# EasyEDA Pro project ProPrj_HTXStudio_OneHanded_Keyboard.epro, schematic TypeC
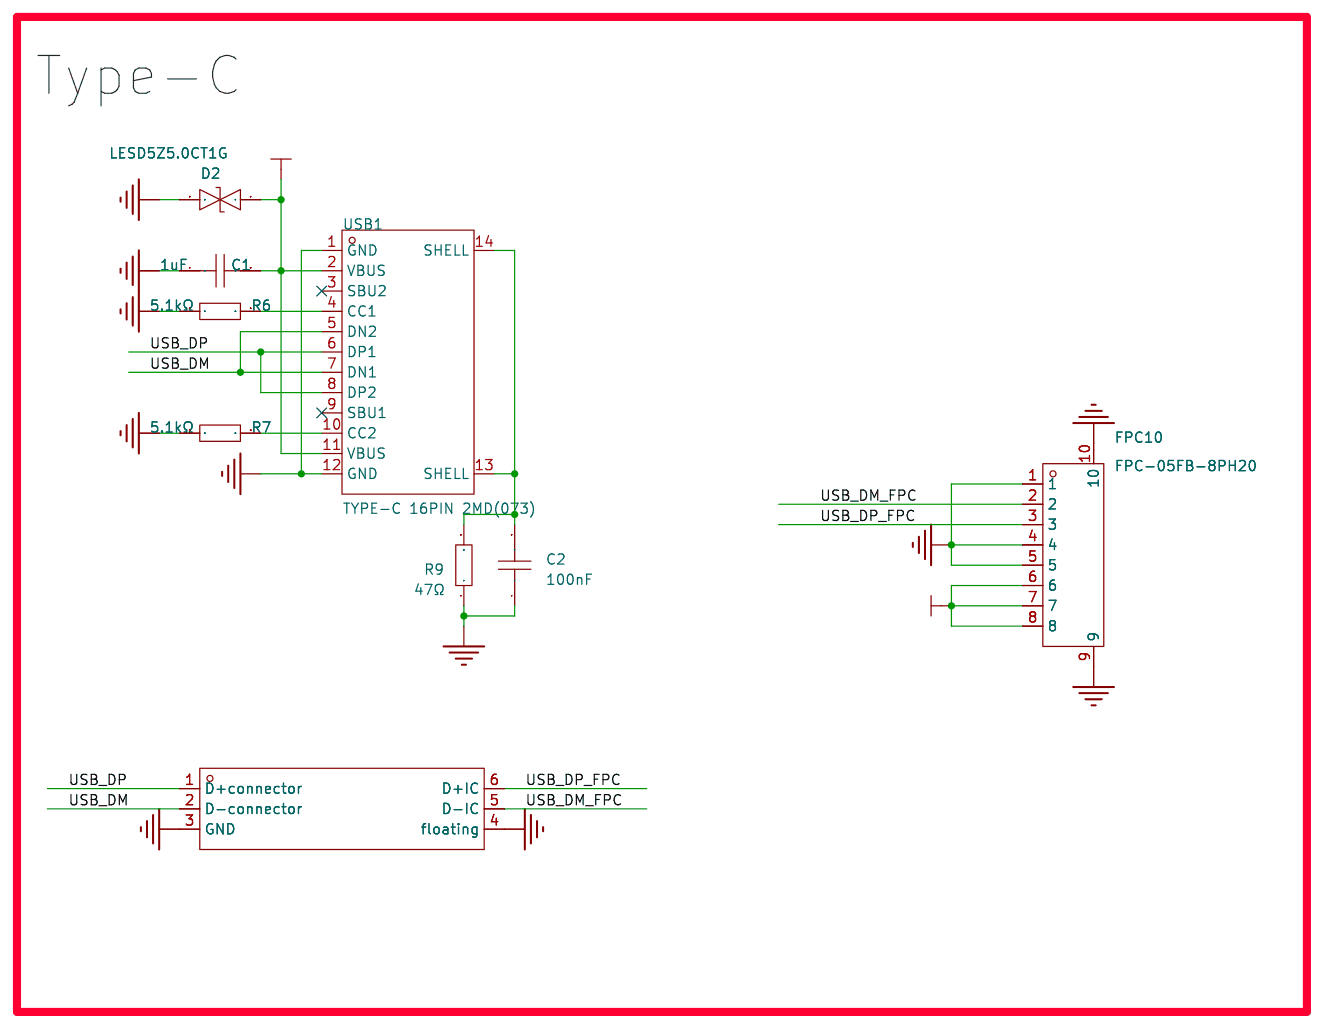
[diagram p0: schematic sheet]

## Parts
C1  1uF  [C0402]
C2  100nF  [C0402]
D2  LESD5Z5.0CT1G  [SOD-523_L1.2-W0.8-LS1.6-BI]
FPC10  FPC-05FB-8PH20  [FPC-SMD_8P-P0.50_XUNPU_FPC-05FB-8PH20]
L1  3Ω  [TDFN-6_L1.4-W1.2-P0.40-BL]
R6  5.1kΩ  [R0402]
R7  5.1kΩ  [R0402]
R9  47Ω  [R0402]
USB1  TYPE-C 16PIN 2MD(073)  [USB-C-SMD_TYPE-C-6PIN-2MD-073]

## Library data of the parts
C1 = CL05A105KA5NQNC: 容值:1uF;精度:±10%;额定电压:25V;材质(温度系数):X5R;; LCSC Part Name: 1uF ±10% 25V; Supplier Part: C52923; Manufacturer: SAMSUNG(三星); Supplier Footprint: 0402; JLCPCB Part Class: Basic Part; Datasheet: https://atta.szlcsc.com/upload/public/pdf/source/20160218/1457707763339.pdf; Supplier: LCSC; Tolerance: ±10%; Voltage Rated: 25V; Temperature Coefficient: X5R
C2 = CL05B104KB54PNC: 容值:100nF;精度:±10%;额定电压:50V;材质(温度系数):X7R;; LCSC Part Name: 100nF ±10% 50V; Supplier Part: C307331; Manufacturer: SAMSUNG(三星); Supplier Footprint: 0402; JLCPCB Part Class: 基础库; Datasheet: https://atta.szlcsc.com/upload/public/pdf/source/20160218/1457707763339.pdf; Supplier: LCSC; Tolerance: ±10%; Voltage Rated: 50V; Temperature Coefficient: X7R
D2 = LESD5Z5.0CT1G: 极性:双向;反向截止电压(Vrwm):5V;最大钳位电压:18.6V;峰值脉冲电流(Ipp):9.4A;击穿电压:5.6V;; LCSC Part Name: 双向ESD; Supplier Part: C136167; Manufacturer: LRC(乐山无线电); Supplier Footprint: SOD-523; JLCPCB Part Class: 扩展库; Datasheet: https://atta.szlcsc.com/upload/public/pdf/source/20171026/C136167_15089841930291059137.pdf; Supplier: LCSC; polarity: 双向; Reverse Stand-Off Voltage (Vrwm): 5V; Maximum Clamping Voltage: 18.6V; Peak Pulse Current (Ipp): 9.4A; Breakdown Voltage: 5.6V; Type: ESD
FPC10 = FPC-05FB-8PH20: 锁定特性:翻盖式;触点类型:双侧触点/上下接;触点数量:8P;间距:0.5mm;安装类型:卧贴;工作温度范围:-25℃~+85℃;; LCSC Part Name: 间距:0.5mm P数:8P 翻盖式 双侧触点/上下接; Supplier Part: C2856828; Manufacturer: XUNPU(讯普); Supplier Footprint: SMD,P=0.5mm,卧贴; JLCPCB Part Class: 扩展库; Datasheet: https://atta.szlcsc.com/upload/public/pdf/source/20210922/C2856828_96968FB666CC1781EEE4F204CBA73B0B.pdf; Supplier: LCSC; Locking Feature: 翻盖式; Contact Type: 双侧触点/上下接; Number of Contacts: 8P; Pitch: 0.5mm; Mounting Type: 卧贴; FFC, FCB Thickness: 0.3mm; Height Above Board: 2mm; Operating Temperature Range: -25℃~+85℃
L1 = ECMF2-40A100N6: 阻值:3Ω;通道数:2;; Supplier Part: C5267592; Manufacturer: ST(意法半导体); Supplier Footprint: QFN-6L; JLCPCB Part Class: 扩展库; Datasheet: https://atta.szlcsc.com/upload/public/pdf/source/20230906/1E2989E99E15DB94BE51E7B0CE6F3E0B.pdf; Supplier: LCSC; Rated Current: 100mA; Number of Channels: 2; OperatingTemperature: -55℃~+125℃
R6 R7 = 0402WGF5101TCE: 电阻类型:厚膜电阻;阻值:5.1kΩ;精度:±1%;功率:62.5mW;最大工作电压:50V;温度系数:±100ppm/℃;; LCSC Part Name: 5.1kΩ ±1% 62.5mW 厚膜电阻; Supplier Part: C25905; Manufacturer: UNI-ROYAL(厚声); Supplier Footprint: 0402; JLCPCB Part Class: 基础库; Datasheet: https://atta.szlcsc.com/upload/public/pdf/source/20200306/C422600_1E6D84923E4A46A82E41ADD87F860B5C.pdf; Supplier: LCSC; Type: 厚膜电阻; Tolerance: ±1%; Power(Watts): 62.5mW; Overload Voltage (Max): 50V; Temperature Coefficient: ±100ppm/℃; Operating Temperature Range: -55℃~+155℃
R9 = 0402WGF470JTCE: 电阻类型:厚膜电阻;阻值:47Ω;精度:±1%;功率:62.5mW;最大工作电压:50V;温度系数:±200ppm/℃;; LCSC Part Name: 47Ω ±1% 62.5mW 厚膜电阻; Supplier Part: C25118; Manufacturer: UNI-ROYAL(厚声); Supplier Footprint: 0402; JLCPCB Part Class: 扩展库; Datasheet: https://atta.szlcsc.com/upload/public/pdf/source/20200306/C422600_1E6D84923E4A46A82E41ADD87F860B5C.pdf; Supplier: LCSC; Type: 厚膜电阻; Tolerance: ±1%; Power(Watts): 62.5mW; Overload Voltage (Max): 50V; Temperature Coefficient: ±200ppm/℃; Operating Temperature Range: -55℃~+155℃
USB1 = TYPE-C 16PIN 2MD(073): 连接器类型:Type-C;标准:USB 3.1;公母:母;安装方式:卧贴;触点数量:16P;端口数量:1;额定电流 - 电源:5A;工作温度范围:-25℃~+85℃;; LCSC Part Name: Type-C 母 卧贴; Supplier Part: C2765186; Manufacturer: SHOU HAN(首韩); Supplier Footprint: SMD; JLCPCB Part Class: 扩展库; Datasheet: https://atta.szlcsc.com/upload/public/pdf/source/20211123/39B17C16241EAC15C5E277BDA434118E.pdf; Supplier: LCSC; Connector Type: Type-C; Standard: USB 3.1; Gender: 母; Mounting Style: 卧贴; Number of Contacts: 16P; Number of Ports: 1; Current Rating - Power (Max): 5A; Operating Temperature Range: -25℃~+85℃; Rated Voltage (Max): 5V; Connect-Disconnect Life: 5千次; Core Colour: 黑色

## Nets
GND: C1.1 C2.1 D2.2 FPC10.1 FPC10.4 FPC10.5 FPC10.9 FPC10.10 L1.3(GND) L1.4(floating) R6.1 R7.1 R9.1 USB1.1(GND) USB1.12(GND)
VBUS: C1.2 D2.1 FPC10.6 FPC10.7 FPC10.8 USB1.2(VBUS) USB1.11(VBUS)
USB_DM: L1.2(D-connector) USB1.5(DN2) USB1.7(DN1)
USB_DM_FPC: FPC10.2 L1.5(D-IC)
USB_DP: L1.1(D+connector) USB1.6(DP1) USB1.8(DP2)
USB_DP_FPC: FPC10.3 L1.6(D+IC)
$1N2982: R6.2 USB1.4(CC1)
$1N2983: R7.2 USB1.10(CC2)
$1N13714: C2.2 R9.2 USB1.13(SHELL) USB1.14(SHELL)

Not connected (* = marked no-connect by the designer): USB1 3(SBU2)* 9(SBU1)*

## Notes on the sheet
- Type-C
